# EAGLE design valve_indicator (EAGLE 9.6.2)

## Sheet 1 of 2: Processor
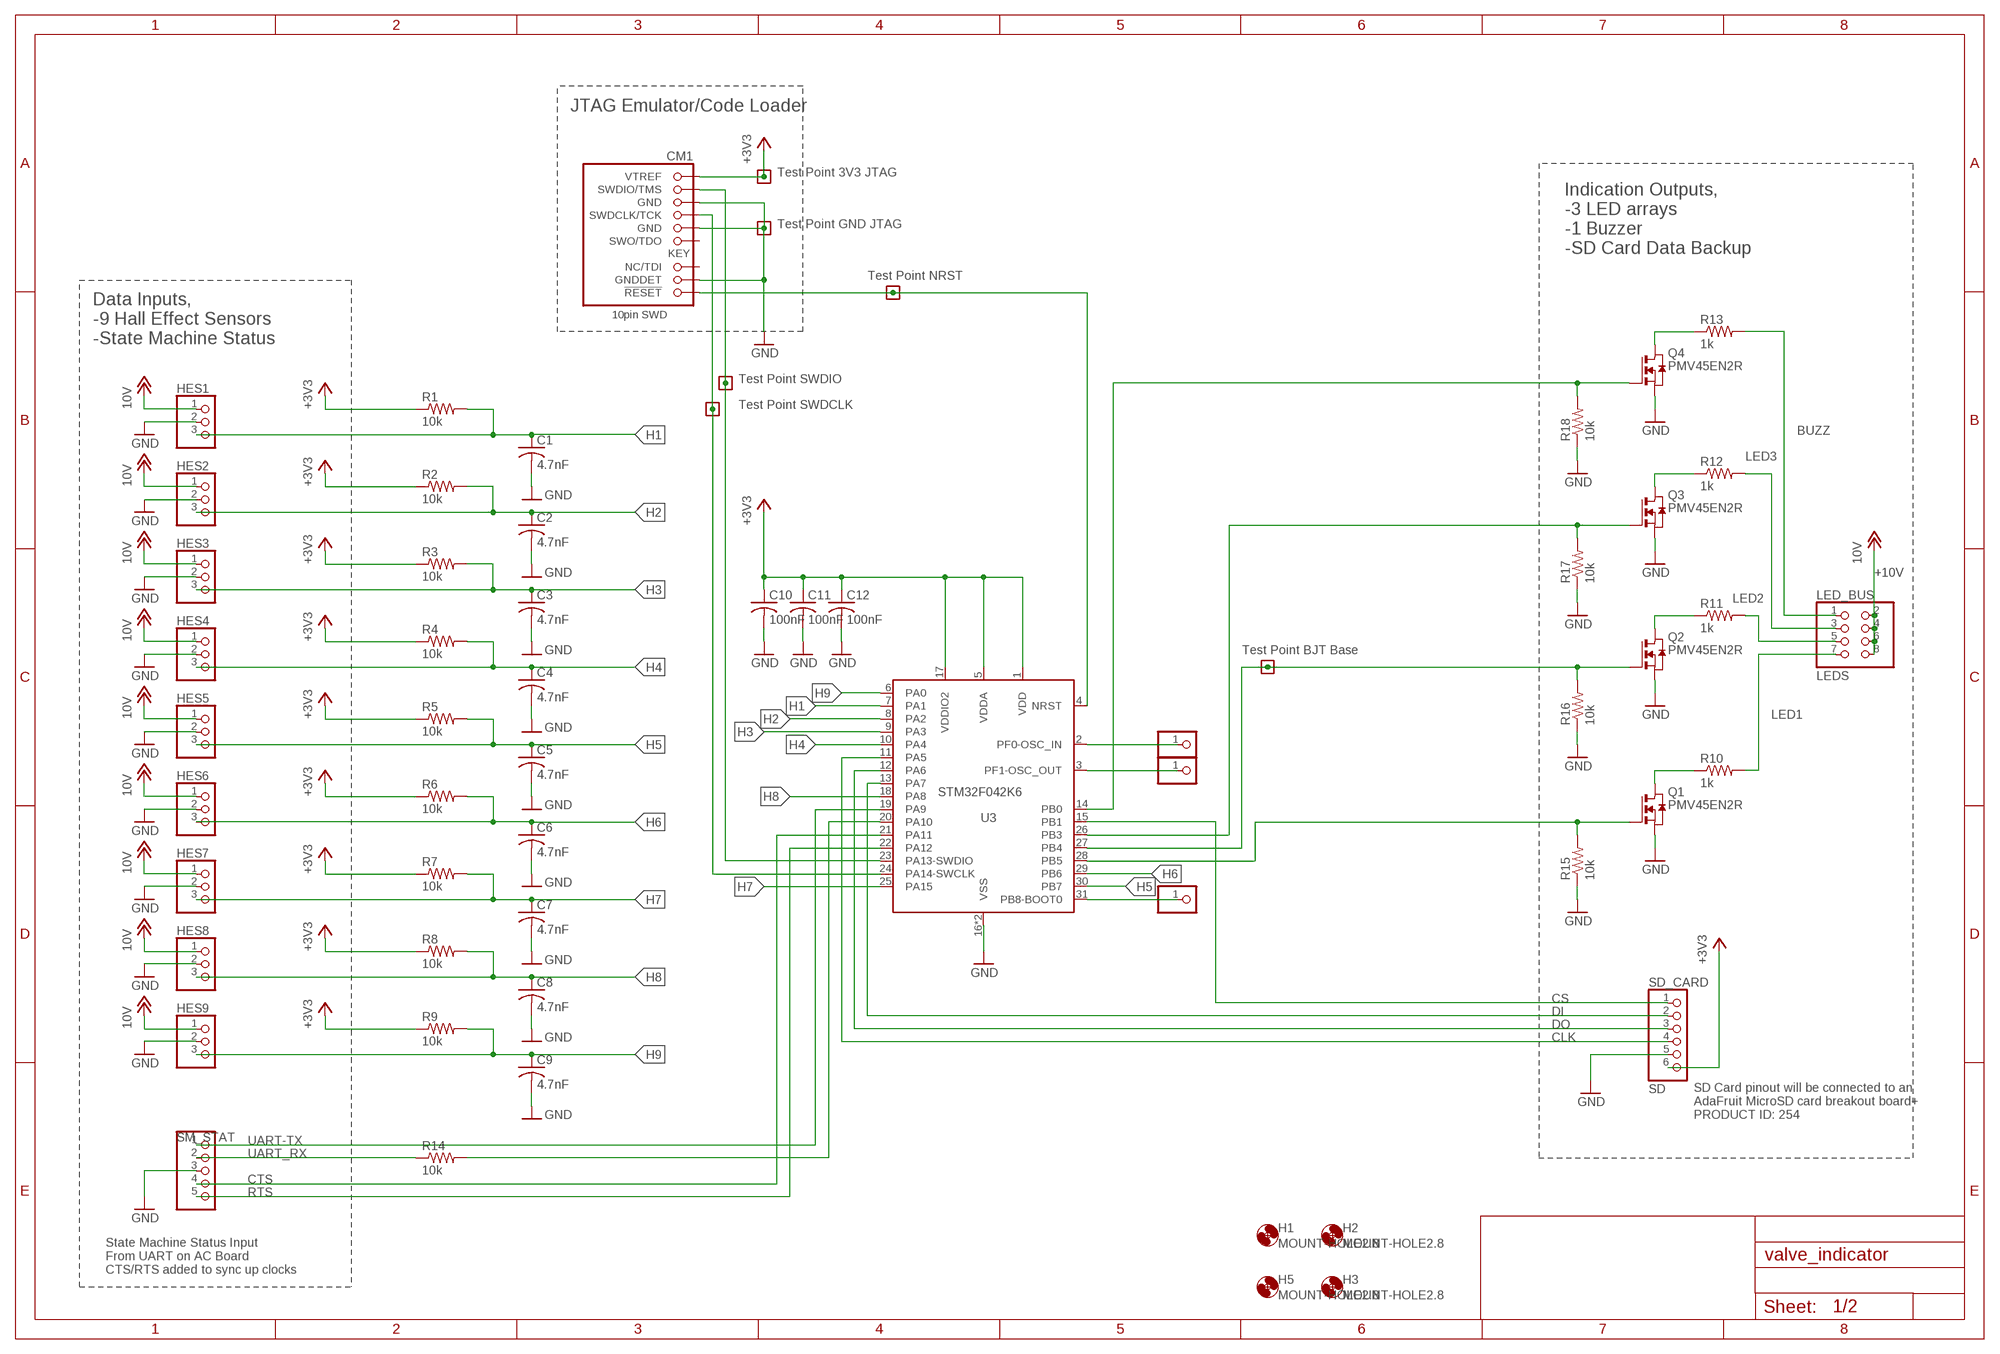
[diagram p0: schematic, sheet 1]

### Parts
C1  4.7nF  C-USC0603  [C0603]
C2  4.7nF  C-USC0603  [C0603]
C3  4.7nF  C-USC0603  [C0603]
C4  4.7nF  C-USC0603  [C0603]
C5  4.7nF  C-USC0603  [C0603]
C6  4.7nF  C-USC0603  [C0603]
C7  4.7nF  C-USC0603  [C0603]
C8  4.7nF  C-USC0603  [C0603]
C9  4.7nF  C-USC0603  [C0603]
C10  100nF  C-USC0603  [C0603]
C11  100nF  C-USC0603  [C0603]
C12  100nF  C-USC0603  [C0603]
CM1  FTSH-105-XX-X-DV-K  [CON10_2X5_DUK_FTSH]
H1  MOUNT-HOLE2.8  [2,8]
H2  MOUNT-HOLE2.8  [2,8]
H3  MOUNT-HOLE2.8  [2,8]
H5  MOUNT-HOLE2.8  [2,8]
HES1  HES1  PINHD-1X3  [1X03]
HES2  HES2  PINHD-1X3  [1X03]
HES3  HES3  PINHD-1X3  [1X03]
HES4  HES4  PINHD-1X3  [1X03]
HES5  HES5  PINHD-1X3  [1X03]
HES6  HES6  PINHD-1X3  [1X03]
HES7  HES7  PINHD-1X3  [1X03]
HES8  HES8  PINHD-1X3  [1X03]
HES9  HES9  PINHD-1X3  [1X03]
JP2  PF0-OSC_IN_PIN  PINHD-1X1  [1X01]
JP3  PF1-OSC_OUT_PIN  PINHD-1X1  [1X01]
JP4  PB8-BOOT0_PIN  PINHD-1X1  [1X01]
LED_BUS  LEDS  PINHD-2X4  [2X04]
Q1  PMV45EN2R  [SOT23]
Q2  PMV45EN2R  [SOT23]
Q3  PMV45EN2R  [SOT23]
Q4  PMV45EN2R  [SOT23]
R1  10k  R-US_R0603  [R0603]
R2  10k  R-US_R0603  [R0603]
R3  10k  R-US_R0603  [R0603]
R4  10k  R-US_R0603  [R0603]
R5  10k  R-US_R0603  [R0603]
R6  10k  R-US_R0603  [R0603]
R7  10k  R-US_R0603  [R0603]
R8  10k  R-US_R0603  [R0603]
R9  10k  R-US_R0603  [R0603]
R10  1k  R-US_R0603  [R0603]
R11  1k  R-US_R0603  [R0603]
R12  1k  R-US_R0603  [R0603]
R13  1k  R-US_R0603  [R0603]
R14  10k  R-US_R0603  [R0603]
R15  10k  R-US_R0603  [R0603]
R16  10k  R-US_R0603  [R0603]
R17  10k  R-US_R0603  [R0603]
R18  10k  R-US_R0603  [R0603]
SD_CARD  SD  PINHD-1X6  [1X06]
SM_STAT  SM_STAT  PINHD-1X5  [1X05]
TP3V3J  TEST-POINT-LARGE-SQUARE  [1X01]
TPBASE  TEST-POINT-LARGE-SQUARE  [1X01]
TPJGND  TEST-POINT-LARGE-SQUARE  [1X01]
TPNRST  TEST-POINT-LARGE-SQUARE  [1X01]
TPSCLK  TEST-POINT-LARGE-SQUARE  [1X01]
TPSIO  TEST-POINT-LARGE-SQUARE  [1X01]
U3  STM32F042K6  [QFP32-7X7]

### Nets
+3V3: C10.1 C11.1 C12.1 CM1.1(VTREF) R1.1 R2.1 R3.1 R4.1 R5.1 R6.1 R7.1 R8.1 R9.1 SD_CARD.6 TP3V3J.1 U3.1(VDD) U3.5(VDDA) U3.17(VDDIO2) ; also sheet 2
+10V: HES1.1 HES2.1 HES3.1 HES4.1 HES5.1 HES6.1 HES7.1 HES8.1 HES9.1 LED_BUS.2 LED_BUS.4 LED_BUS.6 LED_BUS.8 ; supply symbol labelled 10V ; also sheet 2
BUZZ: LED_BUS.1 R13.2
CLK: SD_CARD.4 U3.11(PA5)
CS: SD_CARD.1 U3.15(PB1)
CTS: SM_STAT.4 U3.21(PA11)
DI: SD_CARD.2 U3.13(PA7)
DO: SD_CARD.3 U3.12(PA6)
GND: C1.2 C2.2 C3.2 C4.2 C5.2 C6.2 C7.2 C8.2 C9.2 C10.2 C11.2 C12.2 CM1.3(GND) CM1.5(GND) CM1.9(GNDDET) HES1.2 HES2.2 HES3.2 HES4.2 HES5.2 HES6.2 HES7.2 HES8.2 HES9.2 Q1.2(S) Q2.2(S) Q3.2(S) Q4.2(S) R15.1 R16.1 R17.1 R18.1 SD_CARD.5 SM_STAT.3 TPJGND.1 U3.16(VSS) U3.32(VSS) ; also sheet 2
H1: C1.1 HES1.3 R1.2 U3.7(PA1)
H2: C2.1 HES2.3 R2.2 U3.8(PA2)
H3: C3.1 HES3.3 R3.2 U3.9(PA3)
H4: C4.1 HES4.3 R4.2 U3.10(PA4)
H5: C5.1 HES5.3 R5.2 U3.30(PB7)
H6: C6.1 HES6.3 R6.2 U3.29(PB6)
H7: C7.1 HES7.3 R7.2 U3.25(PA15)
H8: C8.1 HES8.3 R8.2 U3.18(PA8)
H9: C9.1 HES9.3 R9.2 U3.6(PA0)
LED1: LED_BUS.7 R10.2
LED2: LED_BUS.5 R11.2
LED3: LED_BUS.3 R12.2
N$1: Q4.3(D) R13.1
N$6: JP2.1 U3.2(PF0-OSC_IN)
N$7: JP3.1 U3.3(PF1-OSC_OUT)
N$8: JP4.1 U3.31(PB8-BOOT0)
N$9: CM1.4(SWDCLK/TCK) TPSCLK.1 U3.24(PA14-SWCLK)
N$13: Q3.3(D) R12.1
N$22: Q1.1(G) R15.2 U3.28(PB5)
N$24: Q3.1(G) R17.2 U3.26(PB3)
N$26: Q1.3(D) R10.1
N$27: Q2.3(D) R11.1
N$30: CM1.2(SWDIO/TMS) TPSIO.1 U3.23(PA13-SWDIO)
N$32: CM1.10(!RESET) TPNRST.1 U3.4(NRST)
N$34: Q4.1(G) R18.2 U3.14(PB0)
N$35: Q2.1(G) R16.2 TPBASE.1 U3.27(PB4)
RTS: SM_STAT.5 U3.22(PA12)
UART-RX: R14.2 U3.20(PA10)
UART-TX: SM_STAT.1 U3.19(PA9)
UART_RX: R14.1 SM_STAT.2
Unconnected: CM1.6(SWO/TDO) CM1.8(NC/TDI)

### Notes on the sheet
- JTAG Emulator/Code Loader
- Test Point 3V3 JTAG
- Test Point GND JTAG
- Indication Outputs,
  -3 LED arrays
  -1 Buzzer
  -SD Card Data Backup
- Test Point NRST
- Data Inputs, 
  -9 Hall Effect Sensors
  -State Machine Status
- Test Point SWDIO
- Test Point SWDCLK
- Test Point BJT Base
- SD Card pinout will be connected to an 
  AdaFruit MicroSD card breakout board+
  PRODUCT ID: 254
- State Machine Status Input
  From UART on AC Board
  CTS/RTS added to sync up clocks

## Sheet 2 of 2: Power Regulators
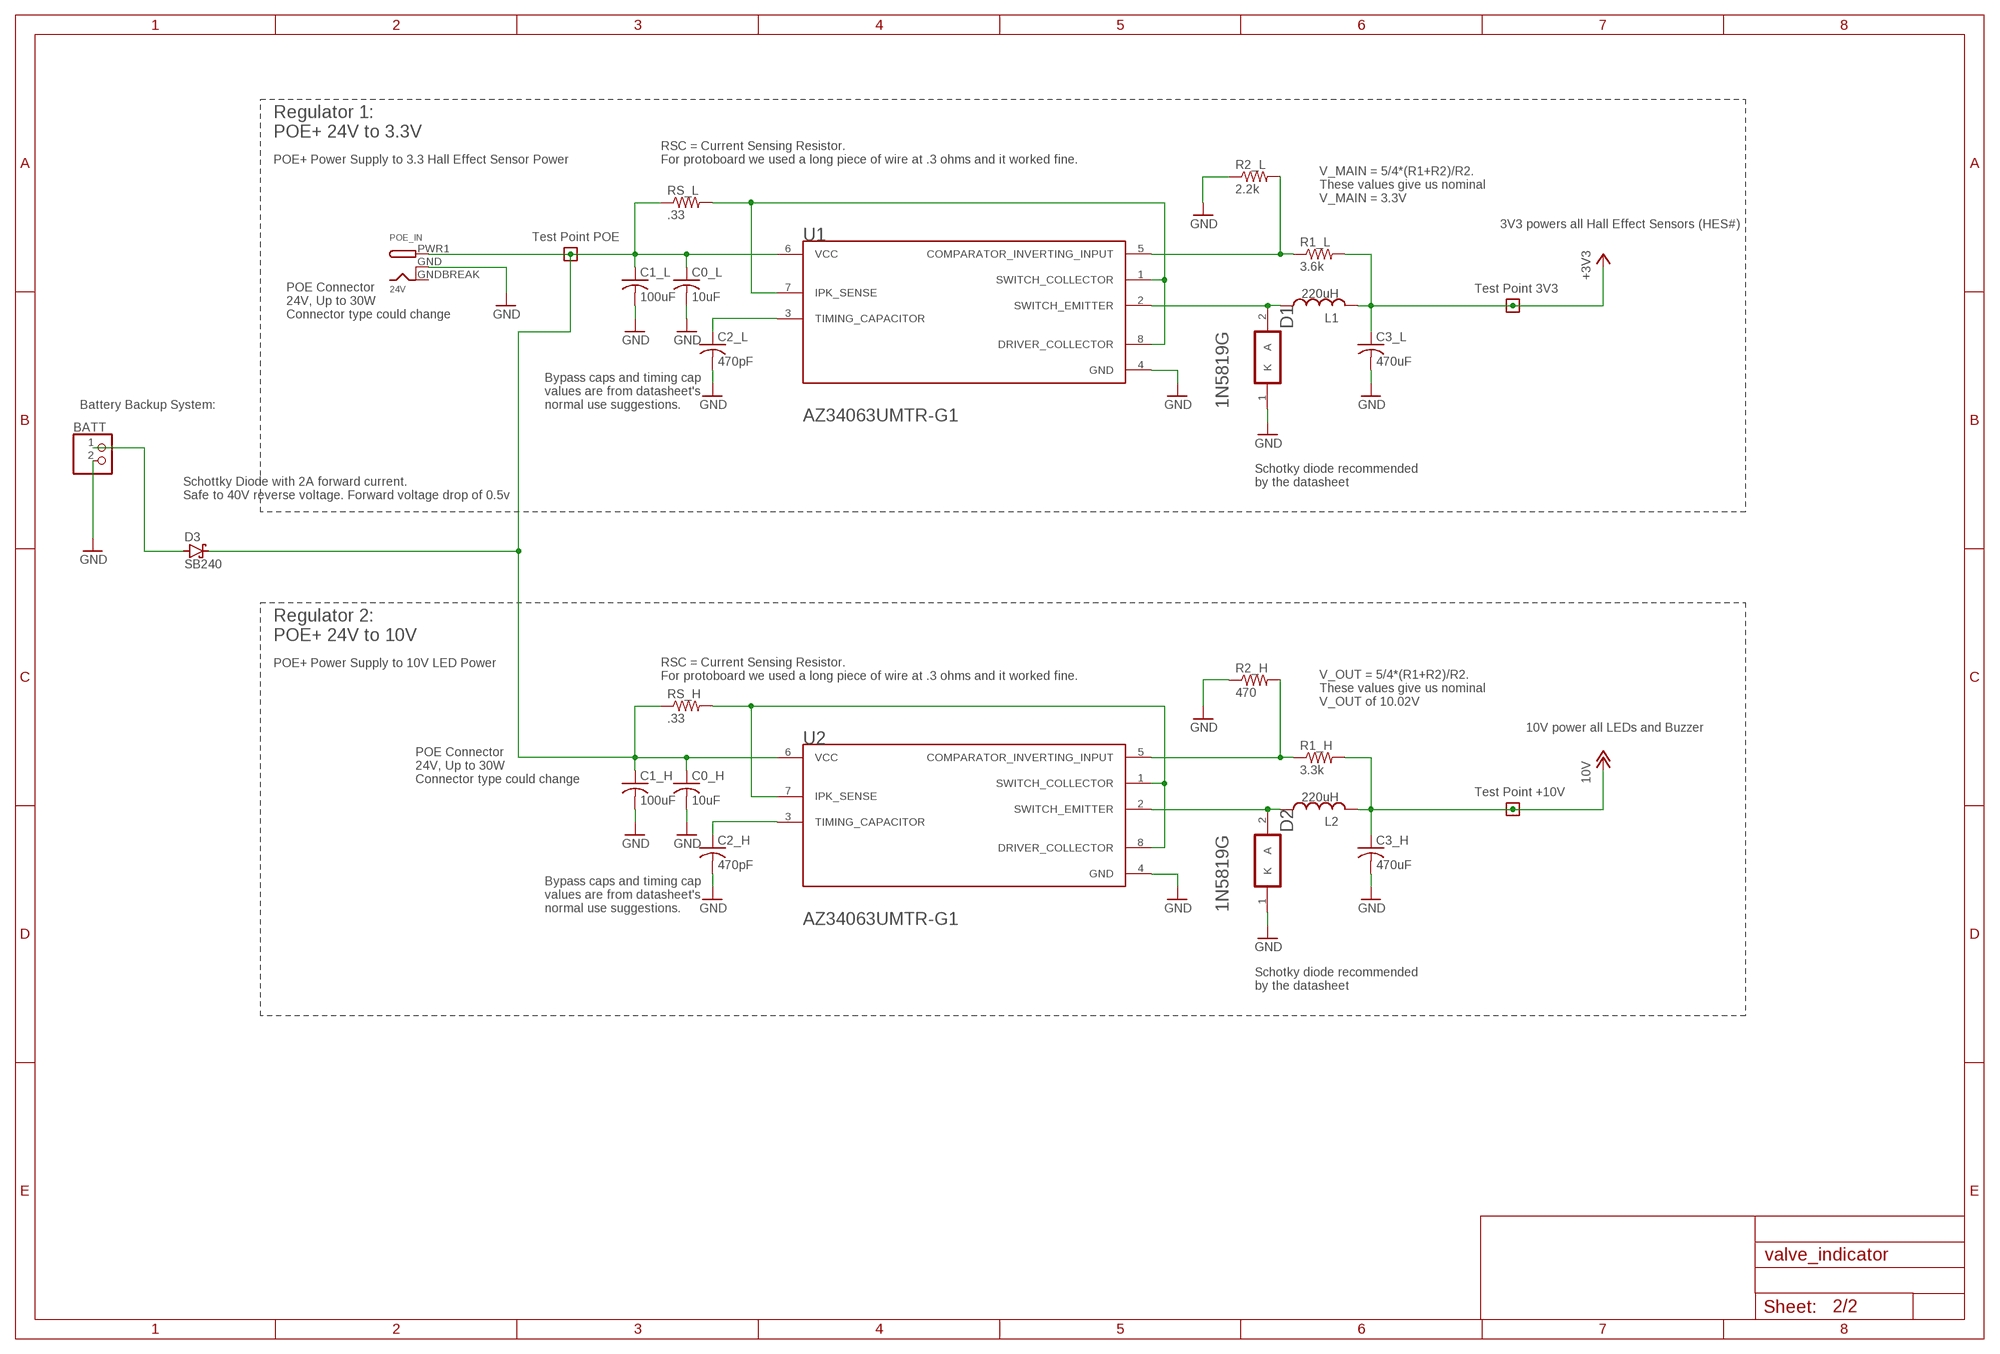
[diagram p1: schematic, sheet 2]

### Parts
BATT  LED1  PINHD-1X2  [1X02]
C0_H  10uF  C-USC1206  [C1206]
C0_L  10uF  C-USC1206  [C1206]
C1_H  100uF  C-US025-025X050  [C025-025X050]
C1_L  100uF  C-US025-025X050  [C025-025X050]
C2_H  470pF  C-USC0603  [C0603]
C2_L  470pF  C-USC0603  [C0603]
C3_H  470uF  C-US025-025X050  [C025-025X050]
C3_L  470uF  C-US025-025X050  [C025-025X050]
D1  1N5819G_0_0  ON_SEMICONDUCTOR_1N5819GON_SEMICONDUCTOR_1N5819G_0_0  [ON_SEMICONDUCTOR_1N5819G_0]
D2  1N5819G_0_0  ON_SEMICONDUCTOR_1N5819GON_SEMICONDUCTOR_1N5819G_0_0  [ON_SEMICONDUCTOR_1N5819G_0]
D3  SB240  1N5817-B  [DO41-7.6]
L1  220uH  L-US0204/5  [0204/5]
L2  220uH  L-US0204/5  [0204/5]
POE_IN  24V  DCBARRELSMT  [DCJACK_2MM_SMT]
R1_H  3.3k  R-US_R0603  [R0603]
R1_L  3.6k  R-US_R0603  [R0603]
R2_H  470  R-US_R0603  [R0603]
R2_L  2.2k  R-US_R0603  [R0603]
RS_H  .33  R-US_R0603  [R0603]
RS_L  .33  R-US_R0603  [R0603]
TP3V3  TEST-POINT-LARGE-SQUARE  [1X01]
TP10V  TEST-POINT-LARGE-SQUARE  [1X01]
TPOE  TEST-POINT-LARGE-SQUARE  [1X01]
U1  AZ34063UMTR-G1  DIODES_INC._AZ34063UMTR-G1DIODES_INC._AZ34063UMTR-G1_0_0  [DIODES_INC._AZ34063UMTR-G1_0]
U2  AZ34063UMTR-G1  DIODES_INC._AZ34063UMTR-G1DIODES_INC._AZ34063UMTR-G1_0_0  [DIODES_INC._AZ34063UMTR-G1_0]

### Nets
+3V3: C3_L.1 L1.2 R1_L.2 TP3V3.1 ; also sheet 1
+10V: C3_H.1 L2.2 R1_H.2 TP10V.1 ; supply symbol labelled 10V ; also sheet 1
GND: BATT.2 C0_H.2 C0_L.2 C1_H.2 C1_L.2 C2_H.2 C2_L.2 C3_H.2 C3_L.2 D1.1(K) D2.1(K) POE_IN.GND(GNDBREAK) R2_H.1 R2_L.1 U1.4(GND) U2.4(GND) ; also sheet 1
N$2: RS_L.2 U1.1(SWITCH_COLLECTOR) U1.7(IPK_SENSE) U1.8(DRIVER_COLLECTOR)
N$3: C2_L.1 U1.3(TIMING_CAPACITOR)
N$4: R1_L.1 R2_L.2 U1.5(COMPARATOR_INVERTING_INPUT)
N$5: D1.2(A) L1.1 U1.2(SWITCH_EMITTER)
N$16: BATT.1 D3.A
N$18: RS_H.2 U2.1(SWITCH_COLLECTOR) U2.7(IPK_SENSE) U2.8(DRIVER_COLLECTOR)
N$19: C2_H.1 U2.3(TIMING_CAPACITOR)
N$20: R1_H.1 R2_H.2 U2.5(COMPARATOR_INVERTING_INPUT)
N$21: D2.2(A) L2.1 U2.2(SWITCH_EMITTER)
POE: C0_H.1 C0_L.1 C1_H.1 C1_L.1 D3.C POE_IN.PWR1(PWR) RS_H.1 RS_L.1 TPOE.1 U1.6(VCC) U2.6(VCC)

### Notes on the sheet
- Regulator 1:
  POE+ 24V to 3.3V
- POE+ Power Supply to 3.3 Hall Effect Sensor Power
- RSC = Current Sensing Resistor.
  For protoboard we used a long piece of wire at .3 ohms and it worked fine.
- V_MAIN = 5/4*(R1+R2)/R2.
  These values give us nominal
  V_MAIN = 3.3V
- 3V3 powers all Hall Effect Sensors (HES#)
- Test Point POE
- Test Point 3V3
- POE Connector 
  24V, Up to 30W 
  Connector type could change
- Battery Backup System:
- Bypass caps and timing cap
  values are from datasheet's
  normal use suggestions.
- Schotky diode recommended
  by the datasheet
- Schottky Diode with 2A forward current. 
  Safe to 40V reverse voltage. Forward voltage drop of 0.5v
- Regulator 2:
  POE+ 24V to 10V
- POE+ Power Supply to 10V LED Power
- RSC = Current Sensing Resistor.
  For protoboard we used a long piece of wire at .3 ohms and it worked fine.
- V_OUT = 5/4*(R1+R2)/R2.
  These values give us nominal
  V_OUT of 10.02V
- 10V power all LEDs and Buzzer
- POE Connector 
  24V, Up to 30W 
  Connector type could change
- Test Point +10V
- Bypass caps and timing cap
  values are from datasheet's
  normal use suggestions.
- Schotky diode recommended
  by the datasheet

## Power pins joined to a net without a drawn wire
GND: POE_IN.GNDBREAK(GND)

## Library data of the parts
BATT = pinhead:PINHD-1X2: PIN HEADER; DIS: Digi-Key; DPN: 900-0022232021-ND; MFR: Molex; MPN: 0022232021
C0_H C0_L = rcl:C-US: CAPACITOR, American symbol; DIS: Digi-Key; DPN: 1276-6736-1-ND; MFR: Samsung Electro-Mechanics; MPN: CL31A106MBHNNNE; SPICEPREFIX: C
C1-C9 = rcl:C-US: CAPACITOR, American symbol; DIS: Digi-Key; DPN: 445-7400-1-ND; MFR: TDK Corporation; MPN: C1608C0G1H472J080AA; SPICEPREFIX: C
C1_H C1_L = rcl:C-US: CAPACITOR, American symbol; DIS: Digi-Key; DPN: 1572-1044-ND; MFR: Illinois Capacitor; MPN: 107CKR050M; SPICEPREFIX: C
C2_H C2_L = rcl:C-US: CAPACITOR, American symbol; DIS: Digi-Key; DPN: 1292-1438-1-ND; MFR: Walsin Technology Corporation; MPN: 0603B471K500CT; SPICEPREFIX: C
C3_H C3_L = rcl:C-US: CAPACITOR, American symbol; DIS: Digi-Key; DPN: 399-15683-ND; MFR: KEMET; MPN: ESH477M050AH4AA; SPICEPREFIX: C
C10-C12 = rcl:C-US: CAPACITOR, American symbol; DIS: Digi-Key; DPN: 1276-1006-1-ND; MFR: Samsung Electro-Mechanics; MPN: CL10B104KA8NNNC; SPICEPREFIX: C
CM1 = J-Samtec-FTSH-105-XXX-DV-K-ARM-SWD:FTSH-105-XX-X-DV-K; DIS: Digi-Key; DPN: SAM13160CT-ND; MFR: Samtec Inc.; MPN: FTSH-105-01-F-DV-K-TR
D1 D2 = On Semiconductor - 1N5819G:ON_SEMICONDUCTOR_1N5819G: ONSC-D-K1A2-2_A; DIS: Digi-Key; DPN: 1N5819GOS-ND; MFR: On Semiconductor; MPN: 1N5819G
D3 = diode:1N581*: 1.0A SCHOTTKY BARRIER RECTIFIER Source: http://www.diodes.com/datasheets/ds23001.pdf; DIS: Digi-Key; DPN: SB240-E3/54GICT-ND; MFR: Vishay Semiconductor Diodes Division; MPN: SB240-E3/54
H1-H3 H5 = holes:MOUNT-HOLE: MOUNTING HOLE with drill center marker
HES1-HES9 = pinhead:PINHD-1X3: PIN HEADER; DIS: Digi-Key; DPN: WM2701-ND; MFR: Molex; MPN: 0022112032
JP2-JP4 = pinhead:PINHD-1X1: PIN HEADER
L1 = rcl:L-US: INDUCTOR, American symbol; DIS: DigiKey; DPN: 811-2101-ND; MFR: Murata Power Solutions Inc.; MPN: 12RS224C; SPICEPREFIX: L
L2 = rcl:L-US: INDUCTOR, American symbol; DIS: Digi-Key; DPN: 811-2101-ND; MFR: Murata Power Solutions Inc.; MPN: 12RS224C; SPICEPREFIX: L
LED_BUS = pinhead:PINHD-2X4: PIN HEADER
POE_IN = adafruit:DCBARREL: 2.0mm DC Barrel Jack DCJACK_2MM_PTH - Through Hole Jack (4UConnector: 05537)
Q1-Q4 = Q-Nexperia-Nchannel-MOSFET-PMV45EN2R:PMV45EN2R: Nexperia PMV45EN2R N-channel MOSFET, 5.1 A, 30 V PMV45EN2, 3-Pin SOT-23 Source: Datasheet <http://uk.rs-online.com/web/p/products/1364806>; DESCRIPTION: Nexperia PMV45EN2R N-channel MOSFET, 5.1 A, 30 V PMV45EN2, 3-Pin SOT-23; DIS: Digi-Key; DPN: 1727-2307-1-ND; HEIGHT: 1.1mm; MANUFACTURER_NAME: Nexperia; MANUFACTURER_PART_NUMBER: PMV45EN2R; MFR: Nexperia USA Inc.; MOUSER_PART_NUMBER: 771-PMV45EN2R; MOUSER_PRICE-STOCK: https://www.mouser.com/Search/Refine.aspx?Keyword=771-PMV45EN2R; MPN: PMV45EN2R; RS_PART_NUMBER: 1364835P; RS_PRICE-STOCK: http://uk.rs-online.com/web/p/products/1364835P
R1-R9 R14-R18 = rcl:R-US_: RESISTOR, American symbol; DIS: Digi-Key; DPN: RMCF0603FT10K0CT-ND; MFR: Stackpole Electronics Inc; MPN: RMCF0603FT10K0; SPICEPREFIX: R
R1_H = rcl:R-US_: RESISTOR, American symbol; DIS: Digi-Key; DPN: 311-3.30KHRCT-ND; MFR: Yageo; MPN: RC0603FR-073K3L; SPICEPREFIX: R
R1_L = rcl:R-US_: RESISTOR, American symbol; DIS: Digi-Key; DPN: 311-3.60KHRCT-ND; MFR: Yageo; MPN: RC0603FR-073K6L; SPICEPREFIX: R
R2_H = rcl:R-US_: RESISTOR, American symbol; DIS: Digi-Key; DPN: A129684CT-ND; MFR: TE Connectivity Passive Product; MPN: CRGCQ0603F470R; SPICEPREFIX: R
R2_L = rcl:R-US_: RESISTOR, American symbol; DIS: Digi-Key; DPN: P2.20KHCT-ND; MFR: Panasonic Electronic Components; MPN: ERJ-3EKF2201V; SPICEPREFIX: R
R10-R13 = rcl:R-US_: RESISTOR, American symbol; DIS: Digi-Key; DPN: RMCF0603JJ1K00CT-ND; MFR: Stackpole Electronics Inc; MPN: RMCF0603JJ1K00; SPICEPREFIX: R
RS_H RS_L = rcl:R-US_: RESISTOR, American symbol; DIS: Digi-Key; DPN: P.33AJCT-ND; MFR: Panasonic Electronic Components; MPN: ERJ-3RQFR33V; SPICEPREFIX: R
SD_CARD = pinhead:PINHD-1X6: PIN HEADER; DIS: Digi-Key; DPN: A33867-ND; MFR: TE Connectivity AMP Connectors; MPN: 5-103635-5
SM_STAT = pinhead:PINHD-1X5: PIN HEADER; DIS: Digi-Key; DPN: WM2701-ND; MFR: Molex; MPN: 0022112032
TP3V3 TP3V3J TP10V TPBASE TPJGND TPNRST TPOE TPSCLK TPSIO = oresat-misc:TEST-POINT-LARGE-SQUARE
U1 U2 = Diodes Inc. - AZ34063UMTR-G1:DIODES_INC._AZ34063UMTR-G1: Buck, Boost Switching Regulator IC Positive or Negative Adjustable 1.25V 1 Output 1.5A (Switch) 8-SOIC (0.154", 3.90mm Width); DIS: Digi-Key; DPN: AZ34063UMTR-G1DICT-ND; MFR: Diodes Incorporated; MPN: AZ34063UMTR-G1
U3 = U-ST-STM32F042K-uC:STM32F042K6; DIS: Digi-Key; DPN: 497-14647-ND; MFR: STMicroelectronics; MPN: STM32F042K6T6

## Board
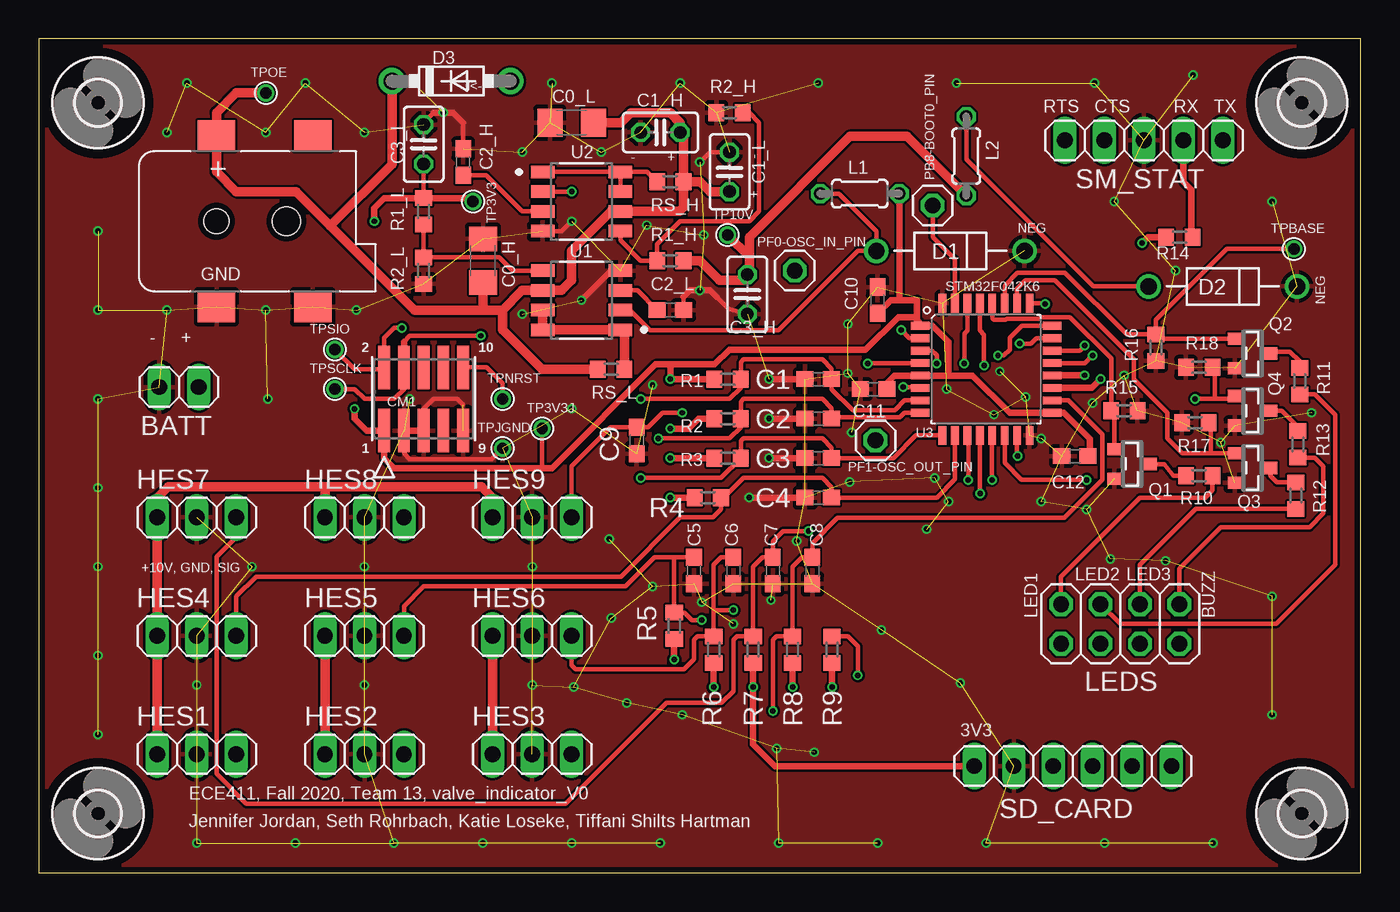
[diagram p2: board, top side]
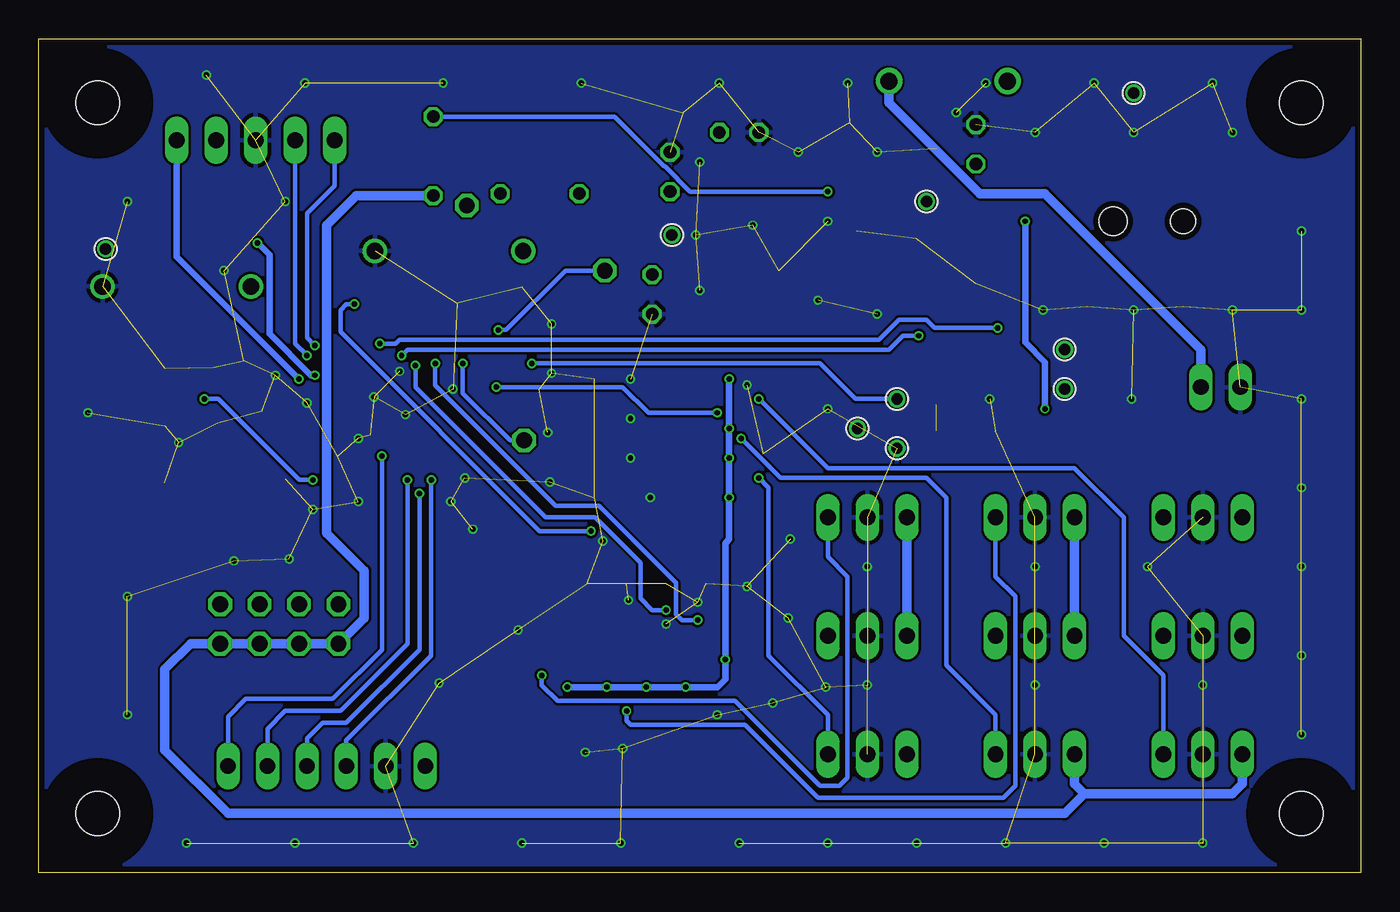
[diagram p3: board, bottom side, seen from below]

Size 85.07 x 53.64 mm. Coordinates in mm from the lower left corner, seen from the top.
Outline: 0,0 85.07,0 85.07,53.64 0,53.64 0,0
Copper layers (1*16): Top 0.035559375mm / dielectric 1.6mm / Bottom 0.035559375mm
Design rules "oshpark-2layer": minimum track width 6mil, minimum drill 10mil, track to track 6mil, track to pad 6mil, pad to pad 6mil, via to via 6mil, smd to smd 6mil, copper to edge 15mil, drill to drill 6mil, minimum pad ring 5mil, minimum via ring 5mil, stop-mask expansion 2.5mil, vias tented up to drill 0mil, thermal gap 10mil

### Footprints (pad centres in the part's own frame; a part is rotated, then mirrored left to right if it is on the bottom)
1X02 = drill 1.016 long: 1 -1.27,0; 2 1.27,0
C1206 = smd 1.6 x 1.8: 1 -1.4,0; 2 1.4,0
C0603 = smd 1.1 x 1: 1 -0.85,0; 2 0.85,0
C025-025X050 = drill 0.813 octagon: 1 -1.27,0; 2 1.27,0
CON10_2X5_DUK_FTSH = smd 0.762 x 2.794: 1 -2.54,-2.032; 2 -2.54,2.032; 3 -1.27,-2.032; 4 -1.27,2.032; 5 0,-2.032; 6 0,2.032; 7 1.27,-2.032; 8 1.27,2.032; 9 2.54,-2.032; 10 2.54,2.032
ON_SEMICONDUCTOR_1N5819G_0 = drill 1.05 pad 1.55: 1 -4.77,0; 2 4.77,0
DO41-7.6 = drill 1.1 pad 1.7: A 3.81,0; C -3.81,0
2,8 = hole 2.8: 0,0
1X03 = drill 1.016 long: 1 -2.54,0; 2 0,0; 3 2.54,0
1X01 = drill 1.016 octagon: 1 0,0
0204/5 = drill 0.813 octagon: 1 -2.54,0; 2 2.54,0
2X04 = drill 1.016 octagon: 1 -3.81,-1.27; 2 -3.81,1.27; 3 -1.27,-1.27; 4 -1.27,1.27; 5 1.27,-1.27; 6 1.27,1.27; 7 3.81,-1.27; 8 3.81,1.27
DCJACK_2MM_SMT = smd 2.4 x 2: GND 0,-5.5; GNDBREAK 6.2,-5.5; PWR1 0,5.5; PWR2 6.2,5.5 | hole 1.6: 0,0 | hole 1.8: 4.5,0
SOT23 = smd 0.787 x 0.889: 1 -0.953,-1.143; 2 0.953,-1.143; 3 0,1.143
R0603 = smd 1 x 1.1: 1 -0.85,0; 2 0.85,0
1X06 = drill 1.016 long: 1 -6.35,0; 2 -3.81,0; 3 -1.27,0; 4 1.27,0; 5 3.81,0; 6 6.35,0
1X05 = drill 1.016 long: 1 -5.08,0; 2 -2.54,0; 3 0,0; 4 2.54,0; 5 5.08,0
1X01' = drill 0.737 pad 1.1: 1 0,0
DIODES_INC._AZ34063UMTR-G1_0 = smd 1.505 x 0.802: 1 -2.498,1.905; 2 -2.498,0.635; 3 -2.498,-0.635; 4 -2.498,-1.905; 5 2.498,-1.905; 6 2.498,-0.635; 7 2.498,0.635; 8 2.498,1.905
QFP32-7X7 = smd 1.2 x 0.5: 1 -4.25,2.8; 2 -4.25,2; 3 -4.25,1.2; 4 -4.25,0.4; 5 -4.25,-0.4; 6 -4.25,-1.2; 7 -4.25,-2; 8 -4.25,-2.8; 17 4.25,-2.8; 18 4.25,-2; 19 4.25,-1.2; 20 4.25,-0.4; 21 4.25,0.4; 22 4.25,1.2; 23 4.25,2; 24 4.25,2.8 | smd 0.5 x 1.2: 9 -2.8,-4.25; 10 -2,-4.25; 11 -1.2,-4.25; 12 -0.4,-4.25; 13 0.4,-4.25; 14 1.2,-4.25; 15 2,-4.25; 16 2.8,-4.25; 25 2.8,4.25; 26 2,4.25; 27 1.2,4.25; 28 0.4,4.25; 29 -0.4,4.25; 30 -1.2,4.25; 31 -2,4.25; 32 -2.8,4.25

### Placement (x,y rotation side)
BATT  9.02,31.24 180 top
C0_H  28.57,39.37 90 top
C0_L  34.29,48.26 180 top
C1  50.16,31.75 180 top
C1_H  40.01,47.62 180 top
C1_L  44.45,45.09 90 top
C2  50.16,29.21 180 top
C2_H  27.3,45.72 90 top
C2_L  40.64,36.2 0 top
C3  50.16,26.67 180 top
C3_H  45.59,37.21 270 top
C3_L  24.77,46.86 90 top
C4  50.16,24.13 180 top
C5  42.16,19.43 270 top
C6  44.7,19.43 270 top
C7  47.24,19.43 270 top
C8  49.78,19.43 270 top
C9  38.48,27.81 270 top
C10  53.98,36.83 90 top
C11  53.72,31.11 180 top
C12  66.67,26.8 180 top
CM1  24.77,30.48 0 top
D1  58.67,40.01 180 top
D2  76.2,37.72 180 top
D3  26.54,50.93 0 top
H1  81.28,3.81 0 top
H2  3.81,49.53 0 top
H3  3.81,3.81 0 top
H5  81.28,49.53 0 top
HES1  10.16,7.62 0 top
HES2  20.95,7.62 0 top
HES3  31.75,7.62 0 top
HES4  10.16,15.24 0 top
HES5  20.95,15.24 0 top
HES6  31.75,15.24 0 top
HES7  10.16,22.86 0 top
HES8  20.95,22.86 0 top
HES9  31.75,22.86 0 top
JP2  48.64,38.73 0 top
JP3  53.85,27.81 0 top
JP4  57.53,42.93 0 top
L1  52.83,43.69 0 top
L2  59.69,46.1 270 top
LED_BUS  69.6,16 180 top
POE_IN  11.43,41.91 0 top
Q1  70.36,26.29 270 top
Q2  78.11,33.4 270 top
Q3  78.11,26.04 270 top
Q4  78.11,29.72 270 top
R1  44.32,31.75 0 top
R1_H  40.64,39.37 0 top
R1_L  24.77,42.55 90 top
R2  44.32,29.21 0 top
R2_H  44.45,48.89 0 top
R2_L  24.77,38.73 90 top
R3  44.32,26.67 0 top
R4  43.05,24.13 0 top
R5  40.89,15.88 90 top
R6  43.43,14.35 90 top
R7  45.97,14.35 90 top
R8  48.51,14.35 90 top
R9  51.05,14.35 90 top
R10  74.68,25.53 0 top
R11  81.15,31.62 270 top
R12  80.9,24.26 270 top
R13  81.03,27.56 270 top
R14  73.41,40.89 180 top
R15  69.85,29.72 180 top
R16  71.88,33.78 90 top
R17  74.42,28.96 0 top
R18  74.68,32.51 0 top
RS_H  40.64,44.45 180 top
RS_L  36.83,32.38 0 top
SD_CARD  66.55,6.86 180 top
SM_STAT  71.12,47.12 180 top
TP3V3  TEST-POINT-LARGE-SQUARE  [1X01']  27.94,43.18 0 top
TP3V3J  TEST-POINT-LARGE-SQUARE  [1X01']  32.38,28.57 0 top
TP10V  TEST-POINT-LARGE-SQUARE  [1X01']  44.32,41.02 0 top
TPBASE  TEST-POINT-LARGE-SQUARE  [1X01']  80.77,40.13 0 top
TPJGND  TEST-POINT-LARGE-SQUARE  [1X01']  29.84,27.3 0 top
TPNRST  TEST-POINT-LARGE-SQUARE  [1X01']  29.84,30.48 0 top
TPOE  TEST-POINT-LARGE-SQUARE  [1X01']  14.61,50.16 0 top
TPSCLK  TEST-POINT-LARGE-SQUARE  [1X01']  19.05,31.11 0 top
TPSIO  TEST-POINT-LARGE-SQUARE  [1X01']  19.05,33.66 0 top
U1  34.92,36.83 180 top
U2  34.92,43.18 0 top
U3  60.96,32.38 0 top

### Tracks (layer width: path | path; a pad name or v marks a point on that pad's centre or on a via)
+3V3  (via drill 0.35)
  Top 0.305: R1_L.2 C3_L.1 | 56.4,35.75 56.71,35.44 U3.1 56.52,35.38 | TP3V3J.1 32.38,26.04
  Top 0.406: v21.59,41.91 21.59,42.76 22.23,43.39 R1_L.2 27.73,43.39 TP3V3.1 | 56.4,35.75 55.31,35.75 53.21,33.66 44.45,33.66 43.5,32.7 40.64,32.7 | 56.52,35.38 56.52,36.83 55.37,36.83 | 58.55,31.98 U3.5 55.06,31.98 54.57,31.5 C11.1 | 58.55,31.98 60.09,31.98 62.49,29.59 U3.17 65.97,29.59 67.65,27.9 67.65,26.92 C12.1 | 58.55,31.98 58.55,34.16 57.52,35.19 U3.1 | 40.64,32.7 39.69,32.7 33.02,26.04 32.38,26.04 22.86,26.04 22.23,26.67 CM1.1 21.08,28.45 20.32,29.21 v20.32,29.84 | C10.1 54.83,36.83 55.37,36.83 | R6.1 v43.43,11.94 | R7.1 v45.97,11.94 45.97,8.25 47.37,6.86 SD_CARD.6 | R8.1 v48.51,11.94 | R9.1 v51.05,11.94 | R5.1 v40.89,13.72 | R4.1 v40.64,24.13 | R3.1 v40.64,26.67 | R2.1 42.46,29.21 41.82,28.57 v40.64,28.57 | R1.1 v40.64,31.75 40.64,32.7 | L1.2 55.37,36.83
  Bottom 0.406: v21.59,41.91 21.59,34.12 20.32,32.85 v20.32,29.84 | v51.05,11.94 v48.51,11.94 v45.97,11.94 v43.43,11.94 41.4,11.94 40.89,12.45 v40.89,13.72 40.89,21.21 40.64,21.46 v40.64,24.13 v40.64,26.67 v40.64,28.57 v40.64,31.75
+10V
  Top 0.305: 45.46,38.1 C3_H.1
  Top 0.61: R1_H.2 42.55,39.37 43.81,38.1 45.46,38.1 | HES8.1 18.41,24.77 18.34,24.84 | HES1.1 HES4.1 HES7.1 7.62,24.13 8.33,24.84 18.34,24.84 | HES2.1 HES5.1 | HES6.1 HES3.1 | TP10V.1 45.72,39.62 | 45.72,39.62 45.72,38.19 C3_H.1 | HES9.1 29.21,24.13 28.5,24.84 18.34,24.84 | 45.72,39.62 45.72,40.89 52.2,47.37 55.88,47.37 L2.2
  Bottom 0.61: L2.2 64.64,43.56 66.55,41.66 66.55,21.84 64.14,19.43 64.14,16.38 LED_BUS.8 LED_BUS.6 LED_BUS.4 LED_BUS.2 75.31,14.73 76.96,13.08 76.96,7.87 72.9,3.81 19.05,3.81 17.78,5.08 | HES5.1 HES8.1 | HES2.1 18.41,5.71 17.78,5.08 | 17.78,5.08 8.26,5.08 7.62,5.71 HES1.1 | HES9.1 HES6.1
BUZZ
  Top 0.305: LED_BUS.1 73.41,19.56 76.07,22.22 81.79,22.22 82.68,23.11 82.68,26.16 82.13,26.71 R13.2
CLK  (via drill 0.35)
  Top 0.305: v59.82,25.27 59.82,28.08 U3.11
  Bottom 0.305: SD_CARD.4 65.28,8.51 59.82,13.97 v59.82,25.27
CS  (via drill 0.35)
  Top 0.305: U3.15 62.96,26.83 v62.99,26.8
  Bottom 0.305: SD_CARD.1 72.9,10.03 71.75,11.18 66.17,11.18 62.99,14.35 v62.99,26.8
CTS  (via drill 0.35)
  Top 0.305: U3.21 67.33,32.79 v67.82,33.27
  Bottom 0.305: v67.82,33.27 68.58,34.04 SM_STAT.4
DI  (via drill 0.35)
  Top 0.305: U3.13 61.34,28.12 v61.34,25.27
  Bottom 0.305: SD_CARD.2 70.36,9.27 69.22,10.41 65.66,10.41 61.34,14.73 v61.34,25.27
DO  (via drill 0.35)
  Top 0.305: v60.58,24.38 60.58,28.12 U3.12
  Bottom 0.305: v60.58,24.38 60.58,14.35 65.28,9.65 66.8,9.65 67.82,8.64 SD_CARD.3
GND  (via drill 0.35)  (136 unrouted)
  Top 0.305: C2_L.2 41.49,37.05 | C2_H.2 27.3,48.26 | 43.6,37.05 44.38,36.27 C3_H.2 | 25.4,48.89 24.77,48.26 C3_L.2 | U2.4 33.66,41.27 v34.29,41.91 | v42.55,45.72 43.18,46.35 C1_L.2 | CM1.3 23.5,26.97 23.88,26.59 29.13,26.59 TPJGND.1 | 27.3,30.1 26.92,30.48 25.4,30.48 24.77,29.84 CM1.5
  Top 0.406: 43.6,37.05 43.18,37.46 v42.55,37.46 41.91,37.46 41.49,37.05 | C4.2 v45.72,24.13 | C3.2 v46.99,26.67 | C2.2 v46.99,29.21 | C1.2 v46.99,31.75 | v34.92,36.83 36.83,38.73 U1.4 | 25.4,48.89 v26.04,48.89 26.67,48.89 27.3,48.26 | CM1.5 CM1.3
  other vias: 8.26,36.2 14.61,36.2 20.45,36.2 73.15,38.73 54.23,15.62 31.75,12.07 31.75,19.68 20.95,19.68 20.95,12.07 10.16,12.07 13.72,19.68 52.32,28.32 34.29,29.84 8.26,47.62 14.61,47.62 20.95,47.62 36.2,46.35 79.38,10.16 79.38,17.78 3.81,41.27 3.81,36.2 3.81,30.48 3.81,24.77 3.81,19.68 3.81,13.97 3.81,8.89 10.16,1.91 16.51,1.91 22.86,1.91 28.57,1.91 34.29,1.91 40.01,1.91 47.62,1.91 53.98,1.91 60.96,1.91 68.58,1.91 75.56,1.91 79.38,43.18 69.22,43.18 74.3,51.31 67.94,50.8 59.05,50.8 50.16,50.8 41.27,50.8 33.02,50.8 24.13,50.8 17.14,50.8 9.53,50.8 31.11,46.35 57.15,22.1 67.44,23.37 14.73,30.48 64.52,27.94 23.88,30.48 39.12,41.66 36.7,21.46 36.83,16.38 39.5,18.41 37.85,10.92 34.42,11.94 47.5,8 49.91,7.75 59.31,12.19 58.55,23.88 64.52,23.88 52.07,35.31 42.8,41.02 31.11,35.94 67.82,30.23 69.85,32 76.07,27.69 81.92,29.59 39.5,31.37 72.52,20.07 68.96,20.19 41.4,10.16 52.07,32.13 47.12,17.53 44.7,16 42.67,17.4 63.5,30.61 61.85,32.26 57.66,25.4 52.2,25.15 48.77,21.34 61.47,29.46 58.42,31.11
  pour Bottom: -0.51,53.72 -0.38,53.85 85.6,53.85 85.6,-0.63 -0.51,-0.63
  pour Top: 0,53.85 85.6,53.85 85.6,-0.38 0,-0.38
H1  (via drill 0.35)
  Top 0.305: v38.73,30.48 44.45,30.48 45.17,31.2 R1.2 45.17,32.85 45.34,33.02 50.42,33.02 51.02,32.42 C1.1 51.02,31.11 52.38,29.75 55.09,29.75 55.72,30.38 U3.7
  Bottom 0.305: v38.73,30.48 34.29,26.04 18.41,26.04 15.24,22.86 15.24,15.24 12.7,12.7 HES1.3
H2  (via drill 0.35)
  Top 0.305: v39.88,27.94 44.45,27.94 45.17,28.66 R2.2 45.17,30.31 45.34,30.48 50.42,30.48 51.02,29.88 C2.1 51.1,29.29 55.4,29.29 55.7,29.59 U3.8
  Bottom 0.305: v39.88,27.94 37.34,25.4 27.94,25.4 26.67,24.13 26.67,13.34 23.5,10.16 HES2.3
H3  (via drill 0.35)
  Top 0.305: v38.73,25.4 43.9,25.4 R3.2 45.17,27.77 45.34,27.94 50.42,27.94 51.02,27.34 C3.1 54.98,26.67 56.45,28.13 U3.9
  Bottom 0.305: HES3.3 34.29,10.16 38.1,13.97 38.1,24.77 v38.73,25.4
H4
  Top 0.305: HES4.3 12.7,17.78 13.97,19.05 37.47,19.05 41.27,22.86 43.4,22.86 43.9,23.37 R4.2 44.07,24.13 45.34,25.4 50.42,25.4 51.02,24.8 C4.1 57.78,24.13 58.96,25.3 U3.10
H5  (via drill 0.35)
  Top 0.305: HES5.3 23.5,17.14 24.77,18.41 37.76,18.41 39.62,20.28 40.89,20.28 | C5.1 40.89,20.28 | v42.67,16.26 42.04,16.26 41.57,16.73 R5.2 40.89,20.28 | v59.56,32.77 59.56,34.66 59.76,34.86 U3.30
  Bottom 0.305: v42.67,16.26 43.69,16.26 44.07,16.64 44.07,18.67 49.02,23.62 51.82,23.62 59.56,31.37 v59.56,32.77
H6  (via drill 0.35)
  Top 0.305: HES6.3 34.29,13.34 34.54,13.08 41.53,13.08 42.16,13.72 42.16,14.99 42.38,15.2 R6.2 43.43,16.89 | C6.1 43.9,20.28 43.43,19.81 43.43,16.89 | v44.7,16.89 43.43,16.89 | v60.83,32.64 60.83,34.61 60.56,34.88 U3.29
  Bottom 0.305: v44.7,16.89 45.59,16.89 46.35,17.65 46.35,19.94 49.28,22.86 52.45,22.86 60.83,31.24 v60.83,32.64
H7  (via drill 0.35)
  Top 0.305: HES7.3 12.7,21.59 11.43,20.32 11.43,6.35 13.34,4.45 33.91,4.45 40.39,10.92 43.94,10.92 44.7,11.68 44.7,14.99 44.92,15.2 R7.2 45.97,19.68 46.57,20.28 C7.1 47.24,21.34 47.88,21.97 v49.53,21.97 | v64.77,36.58 64.71,36.63 U3.25
  Bottom 0.305: v64.77,36.58 65.28,36.58 65.66,36.2 65.66,34.8 52.83,21.97 v49.53,21.97
H8  (via drill 0.35)
  Top 0.305: v47.24,10.41 47.24,14.99 47.46,15.2 R8.2 48.51,19.68 49.11,20.28 C8.1 49.78,21.21 51.4,22.82 66,22.82 68.45,25.27 68.45,28.19 66.26,30.38 U3.18
  Bottom 0.305: v47.24,10.41 47.24,9.78 46.99,9.53 39.62,9.53 34.92,4.83 22.99,4.83 22.23,5.59 22.23,17.78 23.5,19.05 HES8.3
H9  (via drill 0.35)
  Top 0.305: R9.2 52.07,15.2 52.7,14.57 v52.7,12.7 | HES9.3 34.29,26.16 36.79,28.66 C9.1 39.2,28.66 40.13,29.59 v41.4,29.59 | v55.63,31.24 56.65,31.24 U3.6
  Bottom 0.305: HES9.3 34.29,20.32 33.02,19.05 33.02,6.1 33.53,5.59 34.8,5.59 40.26,11.05 51.69,11.05 52.7,12.07 v52.7,12.7 | v55.63,31.24 47.5,31.24 45.85,29.59 v41.4,29.59
LED1
  Top 0.305: R10.2 75.53,24.6 75.06,24.13 70.87,24.13 65.79,19.05 LED_BUS.7
LED2
  Top 0.305: LED_BUS.5 69.6,16 79.63,16 83.44,19.81 83.44,29.46 82.13,30.77 R11.2
LED3
  Top 0.305: LED_BUS.3 70.87,19.81 74.46,23.41 R12.2
N$1
  Top 0.305: Q4.3 80.01,29.72 81.03,28.7 R13.1
N$2
  Top 0.305: U1.1 37.68,34.67
  Top 0.61: U1.7 U1.8 U1.1 | 37.68,34.67 RS_L.2
N$3
  Top 0.305: U1.3 38.52,37.46 C2_L.1
N$4
  Top 0.305: U1.5 30.48,38.73 29.63,39.59 R2_L.2 R1_L.1
N$5
  Top 0.305: U1.2 38.06,36.2 39.35,34.9 47.6,34.9 52.7,40.01 D1.2 53.9,41.27 51.49,43.69 L1.1
N$6  (via drill 0.35)
  Top 0.305: U3.2 56.04,34.38 v55.5,34.92
  Bottom 0.305: v55.5,34.92 54.99,34.92 51.18,38.73 JP2.1
N$7  (via drill 0.35)
  Top 0.305: U3.3 57.47,33.59 57.78,33.27 v57.78,32.77
  Bottom 0.305: v57.78,32.77 57.78,30.86 54.74,27.81 JP3.1
N$8
  Top 0.305: U3.31 58.96,39.46 57.53,40.89 JP4.1
N$9  (via drill 0.35)
  Top 0.305: U3.24 63.25,35.19 62.48,34.42 62.48,33.66 62.1,33.27 v61.72,33.27 | 23.5,34.16 23.88,34.54 v28.45,34.54 | TPSCLK.1 20.32,31.11 20.95,30.48 22.86,30.48 23.5,31.11 23.5,33.02
  Top 0.406: CM1.4 23.5,33.02 23.5,34.16
  Bottom 0.305: v61.72,33.27 61.34,33.66 30.35,33.66 29.46,34.54 v28.45,34.54
N$13
  Top 0.305: R12.1 79.67,25.11 79.25,25.53 Q3.3
N$16
  Bottom 0.61: D3.A 30.35,49.53 24.51,43.69 20.32,43.69 10.29,33.66 BATT.1
N$18
  Top 0.305: U2.7 U2.8 | U2.8 U2.1 | U2.8 39.16,45.09 RS_H.2
N$19
  Top 0.305: C2_H.1 28.79,44.87 31.11,42.55 U2.3
N$20
  Top 0.305: U2.5 37.42,40.68 38.73,39.37 R1_H.1 39.79,40.42 41.27,41.91 45.72,41.91 46.35,42.55 46.35,48.26 45.72,48.89 R2_H.2
N$21  (via drill 0.35)
  Top 0.305: D2.2 67.87,37.72 59.69,45.9 L2.1 | U2.2 v34.29,43.81
  Bottom 0.305: v34.29,43.81 43.16,43.81 44.78,45.44 44.83,45.44 48.03,48.64 L2.1
N$22
  Top 0.305: U3.28 61.36,35.67 61.47,35.56 62.22,35.56 62.3,35.64 64.39,35.64 64.48,35.74 66.37,35.74 69.03,33.08 69.03,29.74 R15.2 69.22,29.5 Q1.1
N$24
  Top 0.305: U3.26 62.96,37.56 63.5,38.1 65.41,38.1 70.48,33.02 70.48,31.75 72.64,29.59 72.64,27.94 73.6,26.99 75.44,26.99 | Q3.1 75.44,26.99 | R17.2 75.44,28.79 75.44,26.99
N$26
  Top 0.305: Q1.3 72.43,26.29 73.03,25.53 R10.1
N$27
  Top 0.305: Q2.3 79.38,33.53 80.52,33.53 81.15,32.89 R11.1
N$30  (via drill 0.35)
  Top 0.305: U3.23 64.19,34.38 63.84,34.04 v63.12,34.04 | v23.37,35.05 22.86,35.05 22.23,34.42 CM1.2 22.1,32.38 20.32,32.38 TPSIO.1
  Bottom 0.305: v63.12,34.04 62.1,34.04 61.85,34.29 30.99,34.29 29.72,35.56 27.94,35.56 27.43,35.05 v23.37,35.05
N$32  (via drill 0.35)
  Top 0.305: U3.4 55.21,32.79 55.19,32.77 v53.34,32.77 | TPNRST.1 29.84,31.5 28.83,32.51 CM1.10
  Bottom 0.305: TPNRST.1 32.51,30.48 34.8,32.77 v53.34,32.77
N$34  (via drill 0.35)
  Top 0.305: v67.44,25.27 63.25,25.27 62.16,26.36 U3.14 | v74.42,30.48 75.69,30.48 | 75.69,30.48 76.77,30.48 Q4.1 | R18.2 75.69,32.35 75.69,30.48
  Bottom 0.305: v74.42,30.48 73.53,30.48 68.33,25.27 v67.44,25.27
N$35
  Top 0.305: U3.27 62.16,37.78 62.99,38.61 66.04,38.61 70.02,34.63 R16.2 | TPBASE.1 76.45,40.13 71.88,35.56 R16.2 | R16.2 72.16,34.35 Q2.1
POE
  Top 0.305: 36.83,42.55 U2.6
  Top 0.61: 18.75,41.61 16.55,43.81 12.7,43.81 11.43,45.09 POE_IN.PWR1 11.43,48.89 12.7,50.16 TPOE.1 | 18.75,41.61 24.17,36.2 28.57,36.2 | 36.83,42.55 34.29,40.01 34.29,38.1 33.66,37.46 U1.6 31.11,37.46 29.84,36.2 | U2.6 41.23,42.55 41.49,42.8 RS_H.1 | 28.57,36.2 29.84,36.2 | RS_L.1 32.38,32.38 29.84,34.92 29.84,36.2 | RS_H.1 42.55,44.45 43.18,43.81 C1_L.1 | RS_H.1 41.49,47.41 C1_H.1 41.27,48.26 40.64,48.89 38.1,48.89 37.47,48.26 C0_L.1 | C0_H.1 28.57,36.2 | D3.C 22.73,45.59 18.75,41.61
RTS  (via drill 0.35)
  Top 0.305: U3.22 66.99,33.59 v67.31,33.91
  Bottom 0.305: v67.31,33.91 67.82,34.42 67.82,42.42 66.04,44.2 SM_STAT.5
UART-RX  (via drill 0.35)
  Top 0.406: U3.20 65.23,32 v67.31,32 | v70.99,40.51 71.37,40.89 R14.2
  Bottom 0.406: v67.31,32 67.56,32 70.23,34.67 70.23,39.75 v70.99,40.51
UART-TX  (via drill 0.35)
  Top 0.406: U3.19 67.76,31.18 v68.33,31.75
  Bottom 0.406: SM_STAT.1 76.2,39.62 v68.33,31.75
UART_RX
  Top 0.406: R14.1 74.17,40.98 74.17,43.94 73.66,44.45 SM_STAT.2

### Text on the board
tNames: l<- | RTS CTS | RX TX | + - | - + | NEG | NEG | - + | +10V, GND, SIG | LED2 | LED3 | LED1 | BUZZ | 3V3 | ECE411, Fall 2020, Team 13, valve_indicator_V0 | Jennifer Jordan, Seth Rohrbach, Katie Loseke, Tiffani Shilts Hartman